# EAGLE design ldr (EAGLE 9.6.2)
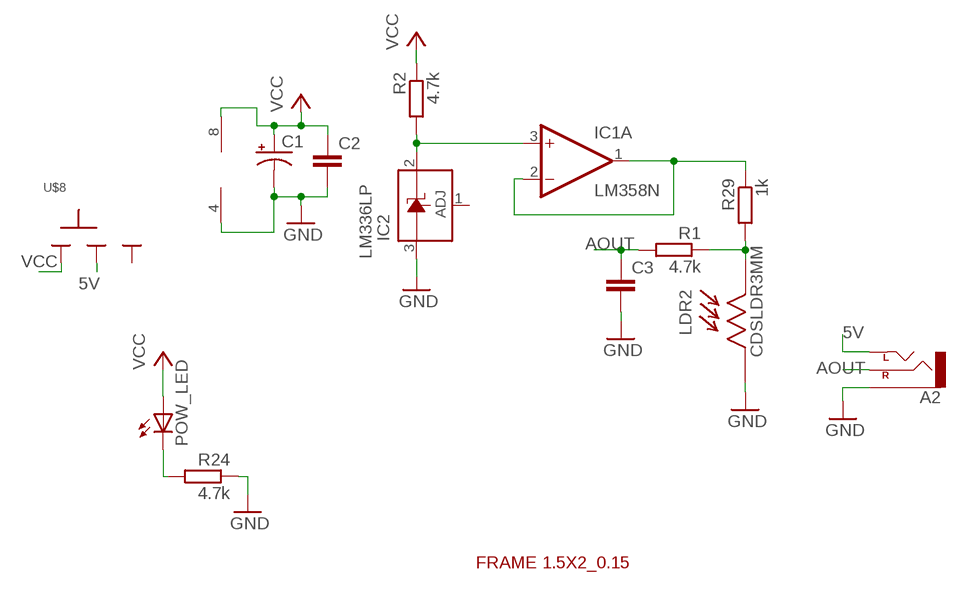
[diagram p0: schematic, sheet 1]

## Parts
A2  AUX-CONNECTOR_CEDT_JANUARY_2015_V5_AUDIO-JACKPTH  [AUX-CONNECTOR_CEDT_JANUARY_2015_V5_AUDIO-JACK]
C1  CAP_POL  [E2,5-5-10U]
C2  C-EU025-024X044  [C025-024X044]
C3  C-EU025-024X044  [C025-024X044]
IC1  LM358N  [DIL08]
IC2  LM336LP  [TO92]
LDR2  CDSLDR3MM  [LDR3MM]
POW_LED  LED3MM  [LED3MM]
R1  4.7k  R-EU_0204/7  [0204/7]
R2  4.7k  R-EU_0204/7  [0204/7]
R24  4.7k  R-EU_0204/7  [0204/7]
R29  1k  R-EU_0204/7  [0204/7]
U$1  FRAME_1.5X2_RAD_0.15  [FRAME_1.5X2_RAD_0.15]
U$8  SLIDESWITCH-BIG  [BIGSWITCH]

## Nets
5V: A2.TIP(LEFT) U$8.2
AOUT: A2.RING(RIGHT) C3.1 R1.2
GND: A2.SLEEVE C1.- C2.2 C3.2 IC1.4(P:V-) IC2.3(A) LDR2.P$2 R24.1
N$1: IC1.3(A:+IN) IC2.2(C) R2.2
N$3: IC1.1(A:OUT) IC1.2(A:-IN) R29.1
N$4: LDR2.P$1 R1.1 R29.2
N$8: POW_LED.K(C) R24.2
VCC: C1.+ C2.1 IC1.8(P:V+) POW_LED.A R2.1 U$8.1
Unconnected: IC1.5(B:+IN) IC1.6(B:-IN) IC1.7(B:OUT) IC2.1(ADJ) U$8.3

## Library data of the parts
A2 = aux-connector:AUX-CONNECTOR_CEDT_JANUARY_2015_V5_AUDIO-JACK: 3.5mm Audio Jack Simple 3.5mm common PCB mount audio jack. SKU: PRT-08032
C1 = CEDT_2022_v4:CAP_POL
C2 C3 = rcl:C-EU: CAPACITOR, European symbol; SPICEPREFIX: C
IC1 = CEDT_2022_v4:LM358: OP AMP also LM158; LM258; LM2904 Source: http://cache.national.com/ds/LM/LM158.pdf
IC2 = linear:LM336: 2.5-V INTEGRATED REFERENCE CIRCUITS LM236 Source: http://focus.ti.com/lit/ds/symlink/lm336-2.5.pdf
LDR2 = CEDT_JANUARY_2015_v6:CDSLDR3MM
POW_LED = CEDT_JANUARY_2015_v6:LED
R1 R2 R24 R29 = rcl:R-EU_: RESISTOR, European symbol; SPICEPREFIX: R
U$1 = CEDT_JANUARY_2015_v6:FRAME_1.5X2_RAD_0.15
U$8 = CEDT_JANUARY_2015_v6:SLIDESWITCH

## Board
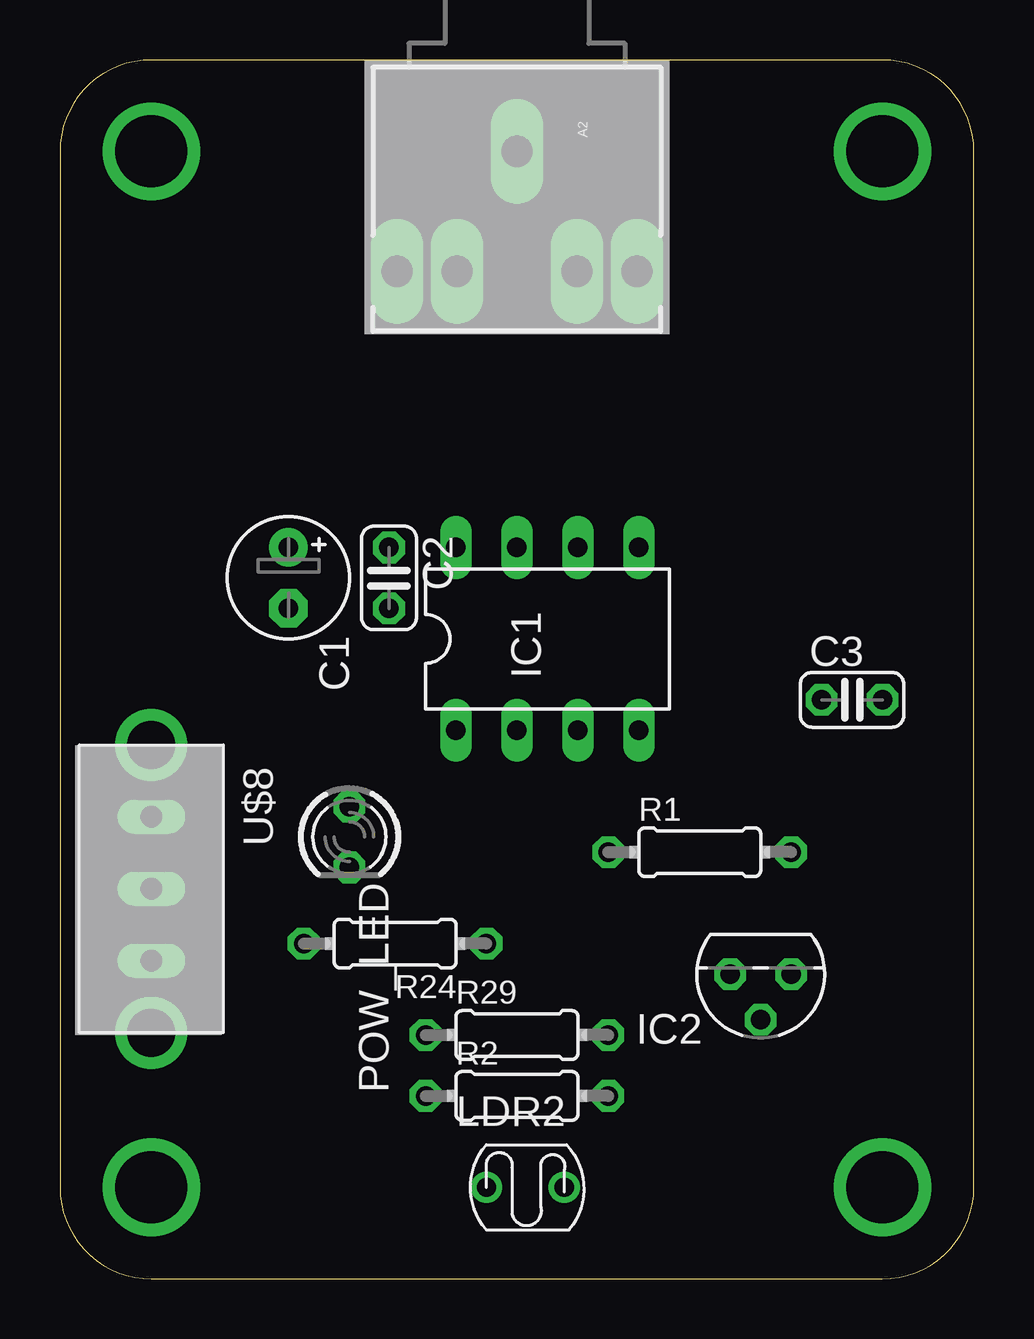
[diagram p1: board, top side]
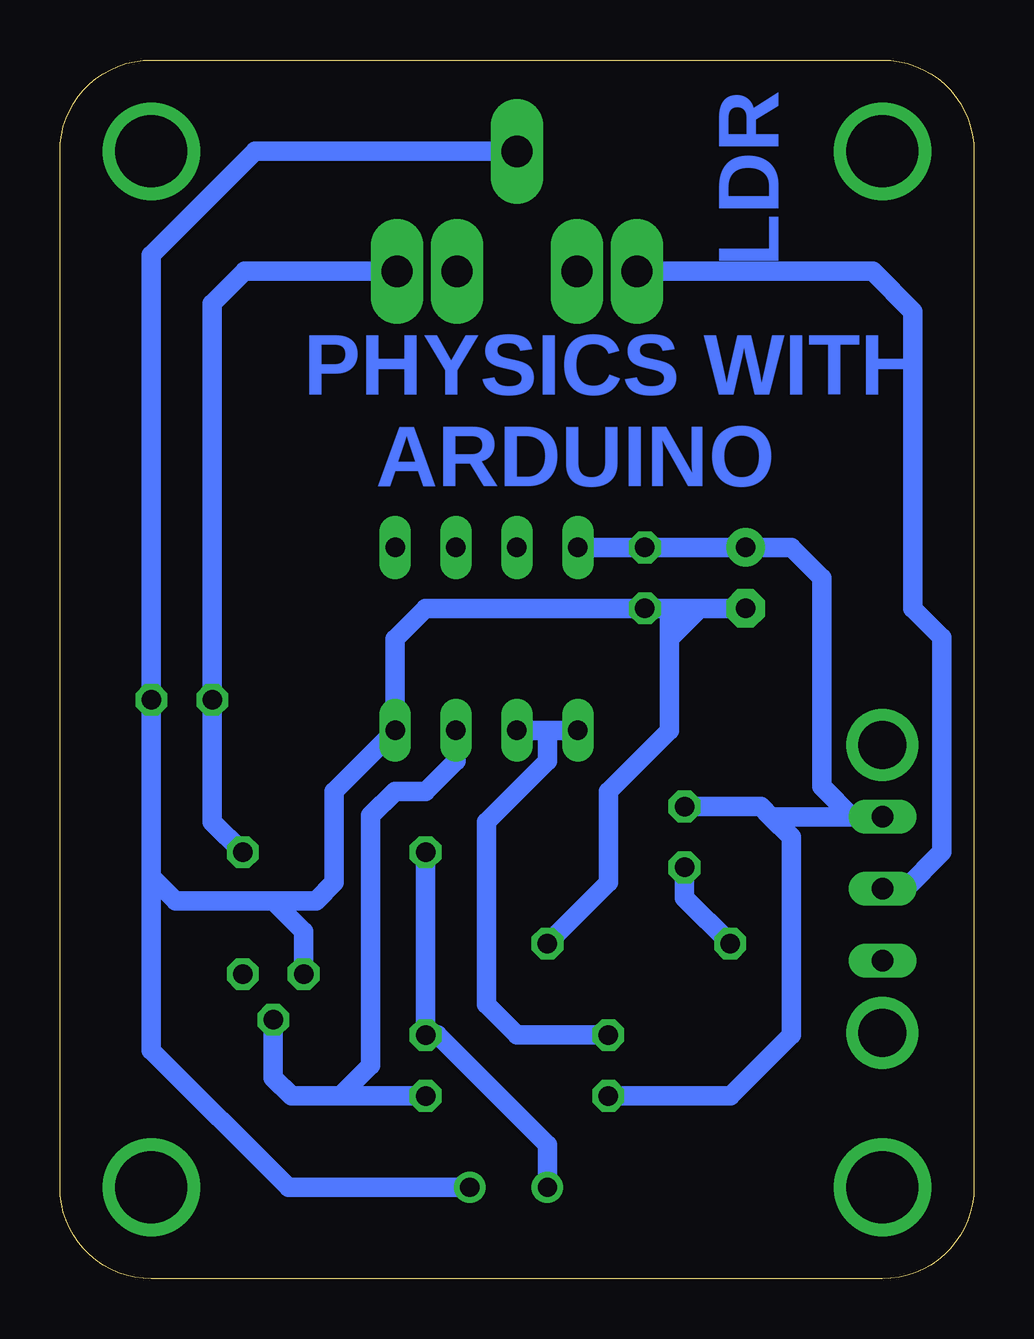
[diagram p2: board, bottom side, seen from below]

Size 38.1 x 50.8 mm. Coordinates in mm from the lower left corner, seen from the top.
Copper layers (1*16): Top 0.035mm / dielectric 1.5mm / Bottom 0.035mm
Design rules "default *": minimum track width 6mil, minimum drill 0.35mm, track to track 16mil, track to pad 16mil, pad to pad 16mil, via to via 16mil, smd to smd 16mil, copper to edge 40mil, drill to drill 6mil, minimum pad ring 10mil, minimum via ring 8mil, stop-mask expansion 4mil, vias tented up to drill 0mil, thermal gap 10mil

### Footprints (pad centres in the part's own frame; a part is rotated, then mirrored left to right if it is on the bottom)
AUX-CONNECTOR_CEDT_JANUARY_2015_V5_AUDIO-JACK = drill 1.3 pad 2.184 long: RING 5,5; RSH 5,2.5; SLEEVE 0,0; TIP 5,-5; TSH 5,-2.5
E2,5-5-10U = drill 0.813 pad 1.6: + -1.27,0 | drill 0.813 pad 1.6 octagon: - 1.27,0
C025-024X044 = drill 0.813 octagon: 1 -1.27,0; 2 1.27,0
DIL08 = drill 0.813 long: 1 -3.81,-3.81; 2 -1.27,-3.81; 3 1.27,-3.81; 4 3.81,-3.81; 5 3.81,3.81; 6 1.27,3.81; 7 -1.27,3.81; 8 -3.81,3.81
TO92 = drill 0.813 octagon: 1 -1.27,0; 2 0,1.905; 3 1.27,0
LDR3MM = drill 0.8: P$1 0,0; P$2 3.24,0
LED3MM = drill 0.813 octagon: A -1.27,0; K 1.27,0
0204/7 = drill 0.813 octagon: 1 -3.81,0; 2 3.81,0
FRAME_1.5X2_RAD_0.15 = drill 2.997 pad 4.064: P$1 3.81,46.99; P$2 34.29,46.99; P$3 34.29,3.81; P$4 3.81,3.81
BIGSWITCH = drill 0.9 long: 1 -3,0; 2 0,0; 3 3,0 | drill 2 pad 2.184: TAB1 -6,0; TAB2 6,0

### Placement (x,y rotation side)
A2  19.05,46.99 270 top
C1  9.53,29.21 270 top
C2  13.72,29.21 270 top
C3  33.02,24.13 0 top
IC1  20.32,26.67 0 top
IC2  29.21,12.7 180 top
LDR2  17.78,3.81 0 top
POW_LED  12.06,18.41 270 top
R1  26.67,17.78 0 top
R2  19.05,7.62 0 top
R24  13.97,13.97 180 top
R29  19.05,10.16 0 top
U$1  0,0 0 top
U$8  3.81,16.26 270 top

### Tracks (layer width: path | path; a pad name or v marks a point on that pad's centre or on a via)
5V
  Bottom 0.813: U$8.2 2.86,16.26 1.33,17.78 1.33,26.73 2.54,27.94 2.54,40.31 4.22,41.99 A2.TIP
AOUT
  Bottom 0.813: R1.2 31.75,19.05 C3.1 31.75,40.64 30.4,41.99 A2.RING
GND
  Bottom 0.813: C1.- 11.43,27.94 | 11.43,27.94 12.7,27.94 | 12.7,27.94 C2.2 22.86,27.94 24.13,26.67 IC1.4 26.67,20.32 26.67,16.51 27.43,15.75 29.21,15.75 | 34.29,16.76 C3.2 34.29,42.67 29.97,46.99 A2.SLEEVE | 29.21,15.75 33.27,15.75 34.29,16.76 | 34.29,16.76 34.29,9.53 28.57,3.81 LDR2.P$2 | R24.1 15.24,16.51 15.24,20.32 12.7,22.86 12.7,26.67 | 12.7,26.67 12.7,27.94 | 11.43,27.94 12.7,26.67 | IC2.3 27.94,14.48 29.21,15.75
N$1
  Bottom 0.813: IC1.3 21.59,21.59 22.86,20.32 24.13,20.32 25.15,19.3 25.15,8.89 26.42,7.62 | 26.42,7.62 28.45,7.62 29.21,8.38 IC2.2 | 26.42,7.62 R2.2
N$3
  Bottom 0.813: IC1.1 17.78,22.86 | 17.78,22.86 IC1.2 | R29.1 19.05,10.16 20.32,11.43 20.32,19.05 17.78,21.59 17.78,22.86
N$4
  Bottom 0.813: LDR2.P$1 17.78,5.59 22.35,10.16 R29.2 R1.1
N$8
  Bottom 0.813: POW_LED.K 12.06,15.88 R24.2
VCC
  Bottom 0.813: IC1.8 C2.1 C1.+ 7.62,30.48 6.35,29.21 6.35,20.53 5.08,19.26 | U$8.1 5.08,19.26 | 5.08,19.26 8.46,19.26 | 8.46,19.26 8.89,19.68 POW_LED.A | R2.1 10.16,7.62 7.62,10.16 7.62,18.41 8.46,19.26

### Text on the board
Bottom: LDR | PHYSICS WITH / ARDUINO